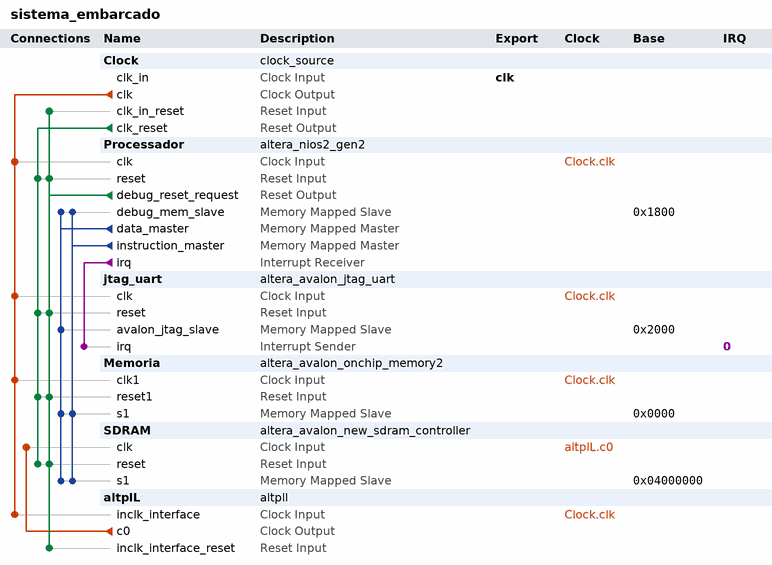
[diagram p0: system contents]
# Platform Designer (Qsys) system sistema_embarcado, Cyclone IV E EP4CE115F29C7
# Parameters at their usual value, and those the tool derives, are not listed.
package require -exact qsys 18.1
create_system sistema_embarcado
set_project_property DEVICE_FAMILY {Cyclone IV E}
set_project_property DEVICE EP4CE115F29C7

add_instance Clock clock_source 18.1
set_instance_parameter_value Clock clockFrequency 50000000

add_instance Processador altera_nios2_gen2 18.1
set_instance_parameter_value Processador dcache_size 2048
set_instance_parameter_value Processador exceptionSlave Memoria.s1
set_instance_parameter_value Processador icache_size 4096
set_instance_parameter_value Processador impl Tiny
set_instance_parameter_value Processador resetSlave Memoria.s1

add_instance jtag_uart altera_avalon_jtag_uart 18.1
set_instance_parameter_value jtag_uart simInteractiveOptions NO_INTERACTIVE_WINDOWS

add_instance Memoria altera_avalon_onchip_memory2 18.1
set_instance_parameter_value Memoria dataWidth 32
set_instance_parameter_value Memoria dualPort false
set_instance_parameter_value Memoria initMemContent true
set_instance_parameter_value Memoria initializationFileName onchip_mem.hex
set_instance_parameter_value Memoria memorySize 4096

add_instance SDRAM altera_avalon_new_sdram_controller 18.1
set_instance_parameter_value SDRAM TAC 5.5
set_instance_parameter_value SDRAM TRCD 20.0
set_instance_parameter_value SDRAM TRP 20.0
set_instance_parameter_value SDRAM casLatency 3
set_instance_parameter_value SDRAM columnWidth 9
set_instance_parameter_value SDRAM dataWidth 16
set_instance_parameter_value SDRAM generateSimulationModel false
set_instance_parameter_value SDRAM model single_Micron_MT48LC4M32B2_7_chip
set_instance_parameter_value SDRAM numberOfBanks 4
set_instance_parameter_value SDRAM numberOfChipSelects 1
set_instance_parameter_value SDRAM powerUpDelay 100.0
set_instance_parameter_value SDRAM refreshPeriod 15.625
set_instance_parameter_value SDRAM rowWidth 13

add_instance altplL altpll 18.1
set_instance_parameter_value altplL CLK0_DIVIDE_BY 25
set_instance_parameter_value altplL CLK0_MULTIPLY_BY 33
set_instance_parameter_value altplL CLK0_PHASE_SHIFT -126
set_instance_parameter_value altplL INCLK0_INPUT_FREQUENCY 20000
set_instance_parameter_value altplL PORT_ARESET PORT_USED
set_instance_parameter_value altplL PORT_LOCKED PORT_USED
set_instance_parameter_value altplL PORT_clk1 PORT_UNUSED
set_instance_parameter_value altplL PORT_clk2 PORT_UNUSED
set_instance_parameter_value altplL PORT_clk3 PORT_UNUSED

# connections
add_connection altplL.c0 SDRAM.clk clock
add_connection Clock.clk altplL.inclk_interface clock
add_connection Clock.clk jtag_uart.clk clock
add_connection Clock.clk Memoria.clk1 clock
add_connection Clock.clk Processador.clk clock
add_connection Clock.clk_reset jtag_uart.reset reset
add_connection Clock.clk_reset Memoria.reset1 reset
add_connection Clock.clk_reset Processador.reset reset
add_connection Clock.clk_reset SDRAM.reset reset
add_connection Processador.debug_reset_request altplL.inclk_interface_reset reset
add_connection Processador.debug_reset_request Clock.clk_in_reset reset
add_connection Processador.debug_reset_request jtag_uart.reset reset
add_connection Processador.debug_reset_request Memoria.reset1 reset
add_connection Processador.debug_reset_request Processador.reset reset
add_connection Processador.debug_reset_request SDRAM.reset reset
add_connection Processador.data_master jtag_uart.avalon_jtag_slave avalon
set_connection_parameter_value Processador.data_master/jtag_uart.avalon_jtag_slave baseAddress 0x2000
add_connection Processador.data_master Memoria.s1 avalon
set_connection_parameter_value Processador.data_master/Memoria.s1 baseAddress 0x0000
add_connection Processador.data_master Processador.debug_mem_slave avalon
set_connection_parameter_value Processador.data_master/Processador.debug_mem_slave baseAddress 0x1800
add_connection Processador.data_master SDRAM.s1 avalon
set_connection_parameter_value Processador.data_master/SDRAM.s1 baseAddress 0x04000000
add_connection Processador.instruction_master Memoria.s1 avalon
set_connection_parameter_value Processador.instruction_master/Memoria.s1 baseAddress 0x0000
add_connection Processador.instruction_master Processador.debug_mem_slave avalon
set_connection_parameter_value Processador.instruction_master/Processador.debug_mem_slave baseAddress 0x1800
add_connection Processador.instruction_master SDRAM.s1 avalon
set_connection_parameter_value Processador.instruction_master/SDRAM.s1 baseAddress 0x04000000
add_connection Processador.irq jtag_uart.irq interrupt
set_connection_parameter_value Processador.irq/jtag_uart.irq irqNumber 0

# exported interfaces
add_interface clk clock sink
set_interface_property clk EXPORT_OF Clock.clk_in

set_interconnect_requirement {$system} qsys_mm.clockCrossingAdapter HANDSHAKE
set_interconnect_requirement {$system} qsys_mm.enableEccProtection FALSE
set_interconnect_requirement {$system} qsys_mm.insertDefaultSlave FALSE
set_interconnect_requirement {$system} qsys_mm.maxAdditionalLatency 1

save_system sistema_embarcado.qsys
